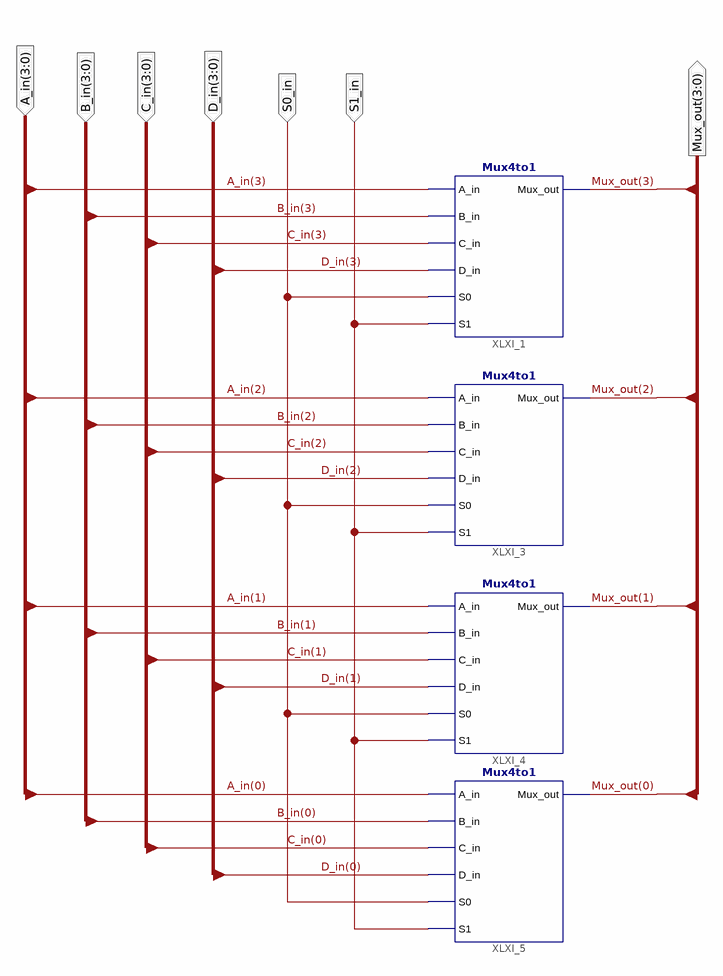
[diagram p0: schematic sheet 1]
// Xilinx ISE schematic Mux4bit.sch (spartan6) as structural Verilog: 4 symbols, 7 ports
module Mux4bit (
  input  [3:0] C_in,
  input  [3:0] D_in,
  input  S0_in,
  input  S1_in,
  input  [3:0] B_in,
  input  [3:0] A_in,
  output [3:0] Mux_out
);

  Mux4to1 XLXI_1 (
    .A_in(A_in[3]), .B_in(B_in[3]), .C_in(C_in[3]), .D_in(D_in[3]), .S0(S0_in), .S1(S1_in),
    .Mux_out(Mux_out[3]));
  Mux4to1 XLXI_3 (
    .A_in(A_in[2]), .B_in(B_in[2]), .C_in(C_in[2]), .D_in(D_in[2]), .S0(S0_in), .S1(S1_in),
    .Mux_out(Mux_out[2]));
  Mux4to1 XLXI_4 (
    .A_in(A_in[1]), .B_in(B_in[1]), .C_in(C_in[1]), .D_in(D_in[1]), .S0(S0_in), .S1(S1_in),
    .Mux_out(Mux_out[1]));
  Mux4to1 XLXI_5 (
    .A_in(A_in[0]), .B_in(B_in[0]), .C_in(C_in[0]), .D_in(D_in[0]), .S0(S0_in), .S1(S1_in),
    .Mux_out(Mux_out[0]));
endmodule
